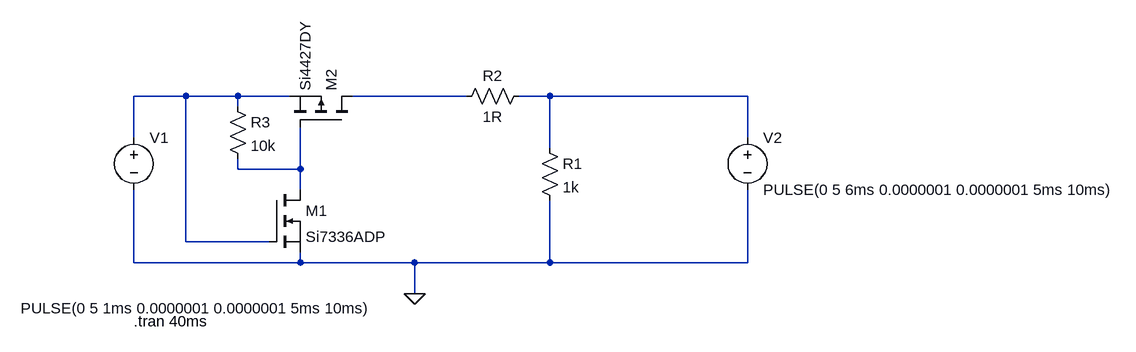
[diagram p0: schematic Draft1.asc]
Draft1.asc, the LTspice schematic file:
Version 4
SHEET 1 1336 680
WIRE -128 112 -208 112
WIRE -48 112 -128 112
WIRE 32 112 -48 112
WIRE 304 112 128 112
WIRE 432 112 384 112
WIRE 736 112 432 112
WIRE -48 128 -48 112
WIRE -208 176 -208 112
WIRE 736 176 736 112
WIRE 432 192 432 112
WIRE -48 224 -48 208
WIRE 48 224 48 160
WIRE 48 224 -48 224
WIRE 48 256 48 224
WIRE -128 336 -128 112
WIRE 0 336 -128 336
WIRE -208 368 -208 256
WIRE 48 368 48 352
WIRE 48 368 -208 368
WIRE 224 368 48 368
WIRE 432 368 432 272
WIRE 432 368 224 368
WIRE 736 368 736 256
WIRE 736 368 432 368
WIRE 224 416 224 368
FLAG 224 416 0
SYMBOL voltage -208 160 R0
WINDOW 3 -174 278 Left 2
WINDOW 123 0 0 Left 0
WINDOW 39 0 0 Left 0
SYMATTR InstName V1
SYMATTR Value PULSE(0 5 1ms 0.0000001 0.0000001 5ms 10ms)
SYMBOL res 416 176 R0
SYMATTR InstName R1
SYMATTR Value 1k
SYMBOL voltage 736 160 R0
WINDOW 123 0 0 Left 0
WINDOW 39 0 0 Left 0
SYMATTR InstName V2
SYMATTR Value PULSE(0 5 6ms 0.0000001 0.0000001 5ms 10ms)
SYMBOL res 400 96 R90
WINDOW 0 0 56 VBottom 2
WINDOW 3 32 56 VTop 2
SYMATTR InstName R2
SYMATTR Value 1R
SYMBOL pmos 128 160 M270
SYMATTR InstName M2
SYMATTR Value Si4427DY
SYMBOL nmos 0 256 R0
SYMATTR InstName M1
SYMATTR Value Si7336ADP
SYMBOL res -64 112 R0
SYMATTR InstName R3
SYMATTR Value 10k
TEXT -208 458 Left 2 !.tran 40ms

The netlist it stands for:
* Draft1.asc
V1 N001 0 PULSE(0 5 1ms 0.0000001 0.0000001 5ms 10ms)
R1 N003 0 1k
V2 N003 0 PULSE(0 5 6ms 0.0000001 0.0000001 5ms 10ms)
R2 N003 N002 1R
M2 N002 N004 N001 N001 Si4427DY
M1 N004 N001 0 0 Si7336ADP
R3 N001 N004 10k
.model NMOS NMOS
.model PMOS PMOS
.lib standard.mos
.tran 40ms
.backanno
.end